# Altium schematic sheet WifiNode_Cpu0.SchDoc: CPU 0
size A4; Author: Matias Pardo Errecarret; Revision: 1; SheetNumber: 3; SheetTotal: 5
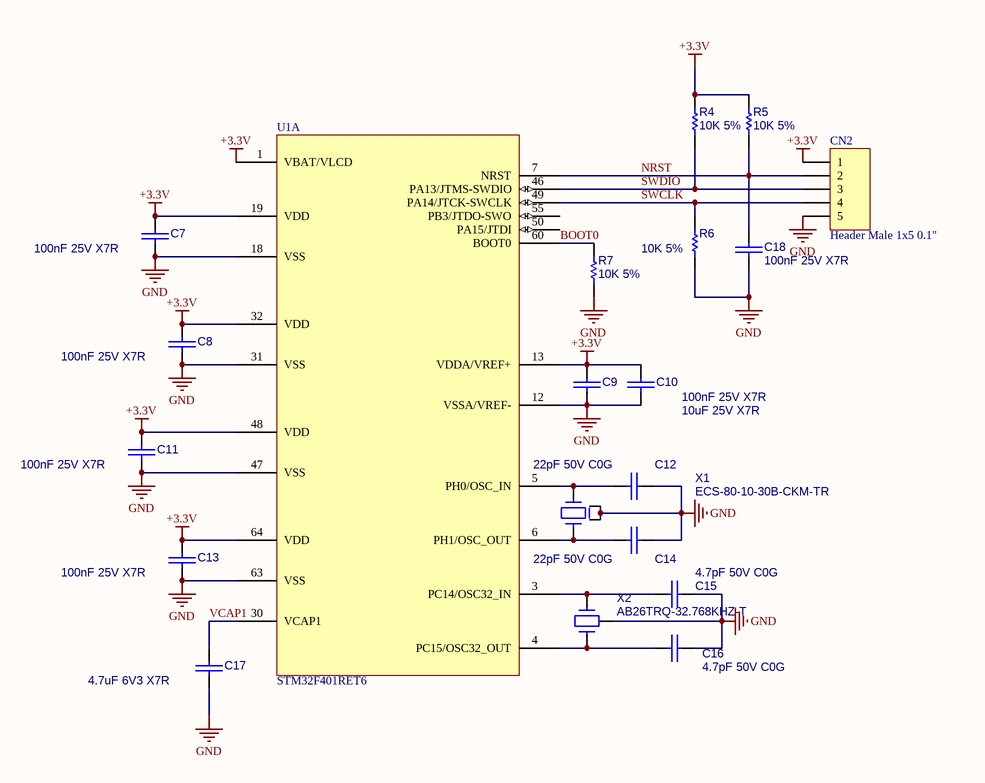
[diagram p0: WifiNode_Cpu0.SchDoc]

## Parts
C7  100nF 25V X7R  [C_0805]
C8  100nF 25V X7R  [C_0805]
C9  100nF 25V X7R  [C_0805]
C10  10uF 25V X7R  [C_0805]
C11  100nF 25V X7R  [C_0805]
C12  22pF 50V C0G  [C_0805]
C13  100nF 25V X7R  [C_0805]
C14  22pF 50V C0G  [C_0805]
C15  4.7pF 50V C0G  [C_0805]
C16  4.7pF 50V C0G  [C_0805]
C17  4.7uF 6V3 X7R  [C_0805]
C18  100nF 25V X7R  [C_0805]
CN2  Header Male 1x5 0.1"  [Header_M_1x5_0.1"]
R4  10K 5%  [R_0805]
R5  10K 5%  [R_0805]
R6  10K 5%  [R_0805]
R7  10K 5%  [R_0805]
U1  STM32F401RET6  (part A of 2)
X1  ECS-80-10-30B-CKM-TR  [ABM3C]
X2  AB26TRQ-32.768KHZ-T  [AB26TQF]

## Nets
+3.3V: C7.1 C8.1 C9.1 C10.1 C11.1 C13.1 CN2.1 R4.2 R5.2 U1.1(VBAT/VLCD) U1.13(VDDA/VREF+) U1.19(VDD) U1.32(VDD) U1.48(VDD) U1.64(VDD)
GND: C7.2 C8.2 C9.2 C10.2 C11.2 C12.2 C13.2 C14.2 C15.2 C16.2 C17.2 C18.2 CN2.5 R6.1 R7.1 U1.12(VSSA/VREF-) U1.18(VSS) U1.31(VSS) U1.47(VSS) U1.63(VSS) X1.2 X1.4 X2.3
BOOT0: R7.2 U1.60(BOOT0)
NRST: C18.1 CN2.2 R5.1 U1.7(NRST)
SWCLK: CN2.4 R6.2 U1.49(PA14/JTCK-SWCLK)
SWDIO: CN2.3 R4.1 U1.46(PA13/JTMS-SWDIO)
VCAP1: C17.1 U1.30(VCAP1)
NetC12_1: C12.1 U1.5(PH0/OSC_IN) X1.1
NetC14_1: C14.1 U1.6(PH1/OSC_OUT) X1.3
NetC15_1: C15.1 U1.3(PC14/OSC32_IN) X2.1
NetC16_1: C16.1 U1.4(PC15/OSC32_OUT) X2.2

Not connected (* = marked no-connect by the designer): U1 50(PA15/JTDI) 55(PB3/JTDO-SWO)

## Notes on the sheet
- Title:
- Size:
- Author:
- A4
- Sheet
- of
- Revision:
- File:
- Date:

## Library data of the parts
C7-C18 = CAP: Non Polarized Capacitor
CN2 = CONN_05P: Connector Generic 5 Vias
R4-R7 = Res1: Resistor
U1 = STM32F401RE: Microcontroller
X1 = CRYSTAL_4P: Crystal 4 Vias + GND
X2 = CRYSTAL 3P: Crystal 2 Vias + GND